# Altium schematic sheet PROB_S7CAS_Title.SchDoc
size Tabloid; SheetNumber: 1; SheetTotal: 15; Sheet_Name: Insert name in Document Parameters; Size: 11x17
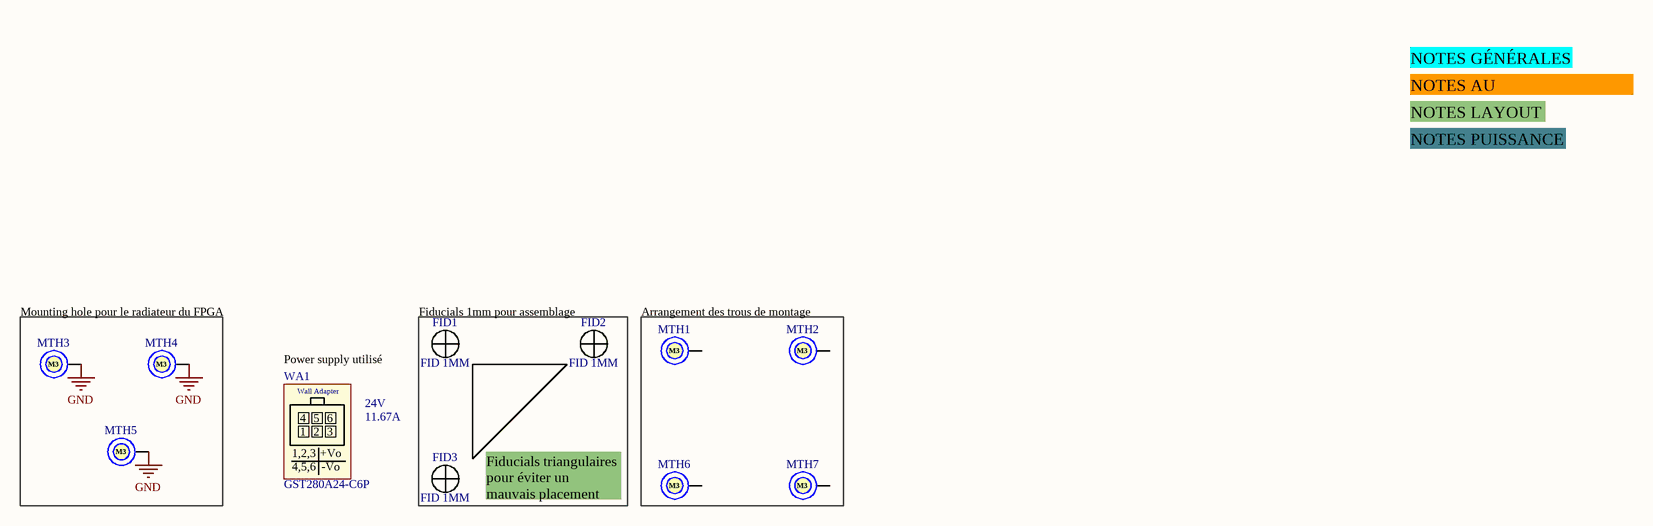
[diagram p0: PROB_S7CAS_Title.SchDoc]

## Parts
FID1  FID 1MM  [FID_CIRCLE_1MM]
FID2  FID 1MM  [FID_CIRCLE_1MM]
FID3  FID 1MM  [FID_CIRCLE_1MM]
MTH1  M3  [MTH_M3]  (no BOM)
MTH2  M3  [MTH_M3]  (no BOM)
MTH3  M3  [MTH_M3]  (no BOM)
MTH4  M3  [MTH_M3]  (no BOM)
MTH5  M3  [MTH_M3]  (no BOM)
MTH6  M3  [MTH_M3]  (no BOM)
MTH7  M3  [MTH_M3]  (no BOM)
WA1  GST280A24-C6P  value 24V  Current Rating: 11.67A  [Model Name]  (mechanical)

## Nets
GND: MTH3.1 MTH4.1 MTH5.1

Not connected (* = marked no-connect by the designer): FID1 1 2; FID2 1 2; FID3 1 2; MTH1 1; MTH2 1; MTH6 1; MTH7 1

## Notes on the sheet
- LÉGENDE NOTES
- NOTES GÉNÉRALES
- NOTES AU PROGRAMMEUR
- NOTES LAYOUT
- NOTES PUISSANCE
- Mounting hole pour le radiateur du FPGA
- Fiducials 1mm pour assemblage
- Arrangement des trous de montage
- Power supply utilisé
- Fiducials triangulaires pour éviter un mauvais placement
- Revision history
- Package size conversion
- Metric
- 1005
- 1608
- Imperial
- 0402
- 0603
- Revision
- 2012
- 3216
- 0805
- 1206
- 3225
- 6432
- 1210
- 2512
- Date :
- Project Title
- Global Project
- Size
- Group
- Date
- Sheet
- of
- Filename
- Designers
- (in symbol UND_GST280A24-C6P) Wall Adapter; 4; 5; 6; 1; 2; 3; 1,2,3; +Vo; 4,5,6; -Vo

## Library data of the parts
FID1-FID3 = FID_CIRCLE_1MM: FID - FIDUCIAL 1MM CIRCLE DOUBLE-SIDED - 1MM; GRAMS Lib Spec: 2.8; Magnetic Material: NO; Cryo: UNKNOWN; Value: *; Tolerance: *; Voltage Rating: *; Current Rating: *; Power Max: *; HelpURL: https://www.pcb-3d.com/wordpress/wp-content/uploads/ipc-sm-782a_amendment_1_and_2.pdf; CreatedBy/Date: Jonathan Bouchard 2018-07-23; VerifiedBy: Caroline Paulin - 25 juillet 2018; Temperature: *; Package: 1MM CIRCLE; Manufacturer #1: *; Manufacturer #2: *; Note: *; Assembly Type: NONE; Part Number #2: *; Part Number #1: *; Polarized: *; Supplier 1: *; Supplier Part Number 1: *
MTH1-MTH7 = MTH_M3: MTH - MOUNTING HOLE M3 PLATED - M3; GRAMS Lib Spec: 2.8; Magnetic Material: NO; Cryo: UNKNOWN; Value: *; Tolerance: *; Voltage Rating: *; Current Rating: *; Power Max: *; HelpURL: https://littlemachineshop.com/images/gallery/PDF/TapDrillSizes.pdf; CreatedBy/Date: Jonathan Bouchard 2018-07-23; VerifiedBy: Arnaud Samson 23-07-18; Temperature: *; Package: M3; Manufacturer #1: *; Manufacturer #2: *; Note: *; Assembly Type: NONE; Part Number #2: *; Part Number #1: *; Polarized: *; Supplier 1: *; Supplier Part Number 1: *
WA1 = UND_GST280A24-C6P: UND - AC/DC DESKTOP ADAPTER 24V 280W - MEC; Manufacturer #1: MEAN WELL USA Inc.; Tolerance: ±3%; Voltage Rating: 85~264VAC; GRAMS Lib Spec: 2.8; Magnetic Material: Unknown; Polarized: Yes; Power Max: 280W; HelpURL: https://www.meanwell.com/Upload/PDF/GST280A/GST280A-SPEC.PDF; CreatedBy/Date: Caroline Paulin - 5 avril 2019; VerifiedBy: Nicolas V. (2019-07-05); Temperature: -30°C to +70°C; Package: -; Manufacturer #2: *; Note: *; Assembly Type: -; Part Number #2: *; Part Number #1: GST280A24-C6P; Supplier 1: Digi-Key; Supplier Part Number 1: 1866-2122-ND; Cryo: UNKNOWN